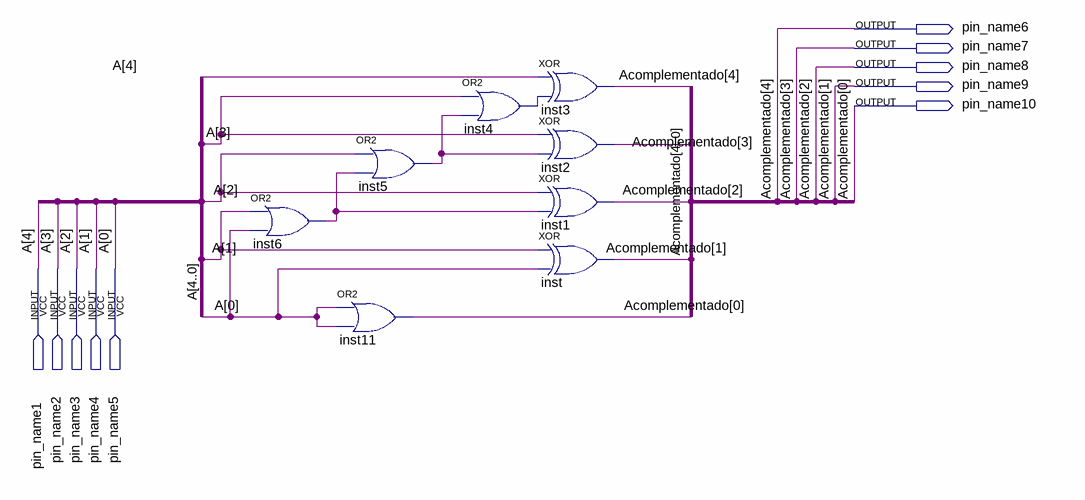
[diagram p0: schematic sheet]
// Quartus schematic complementador de 2.bdf as structural Verilog: 8 symbols, 10 pins
module \complementador_de_2  (
  input  pin_name1,
  input  pin_name2,
  input  pin_name3,
  input  pin_name4,
  input  pin_name5,
  output pin_name6,
  output pin_name7,
  output pin_name8,
  output pin_name9,
  output pin_name10
);

  wire inst4_out, inst5_out, inst6_out;

  or inst6 (inst6_out, pin_name4, pin_name5);
  or inst11 (pin_name10, pin_name5, pin_name5);
  or inst5 (inst5_out, pin_name3, inst6_out);
  or inst4 (inst4_out, pin_name2, inst5_out);
  xor inst3 (pin_name6, pin_name1, inst4_out);
  xor inst2 (pin_name7, pin_name2, inst5_out);
  xor inst1 (pin_name8, pin_name3, inst6_out);
  xor inst (pin_name9, pin_name4, pin_name5);

  // Other names for the same wires on the sheet: A[4:0] = {pin_name1, pin_name2, pin_name3, pin_name4, pin_name5};
  //   Acomplementado[4:0] = {pin_name6, pin_name7, pin_name8, pin_name9, pin_name10}
endmodule
